# EAGLE schematic untitled (EAGLE 7.3.0)
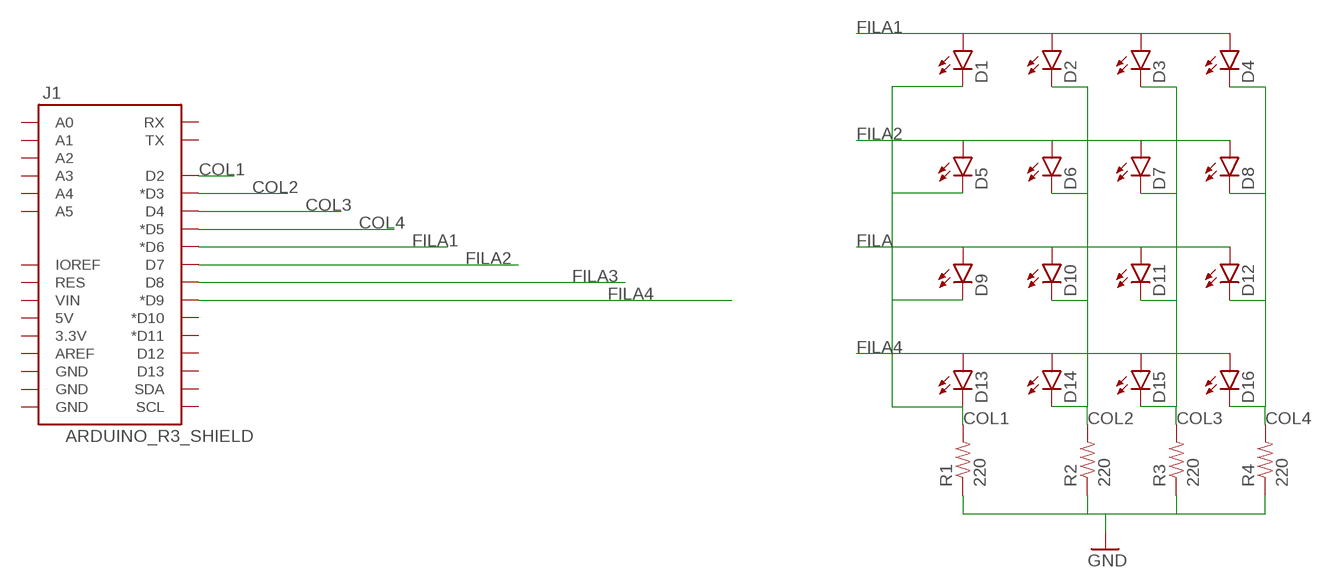
[diagram p0: schematic, sheet 1]

## Parts
D1  LED5MM  [LED5MM]
D2  LED5MM  [LED5MM]
D3  LED5MM  [LED5MM]
D4  LED5MM  [LED5MM]
D5  LED5MM  [LED5MM]
D6  LED5MM  [LED5MM]
D7  LED5MM  [LED5MM]
D8  LED5MM  [LED5MM]
D9  LED5MM  [LED5MM]
D10  LED5MM  [LED5MM]
D11  LED5MM  [LED5MM]
D12  LED5MM  [LED5MM]
D13  LED5MM  [LED5MM]
D14  LED5MM  [LED5MM]
D15  LED5MM  [LED5MM]
D16  LED5MM  [LED5MM]
J1  ARDUINO_R3_SHIELD  [UNO_R3_SHIELD]
R1  220  RESISTORPTH-1/4W  [AXIAL-0.4]
R2  220  RESISTORPTH-1/4W  [AXIAL-0.4]
R3  220  RESISTORPTH-1/4W  [AXIAL-0.4]
R4  220  RESISTORPTH-1/4W  [AXIAL-0.4]

## Nets
COL1: D1.K(C) D5.K(C) D9.K(C) D13.K(C) J1.D2 R1.P$2
COL2: D2.K(C) D6.K(C) D10.K(C) D14.K(C) J1.D3(*D3) R2.P$2
COL3: D3.K(C) D7.K(C) D11.K(C) D15.K(C) J1.D4 R3.P$2
COL4: D4.K(C) D8.K(C) D12.K(C) D16.K(C) J1.D5(*D5) R4.P$2
FILA: D12.A
FILA1: D4.A J1.D6(*D6)
FILA2: D8.A J1.D7
FILA3: J1.D8
FILA4: D16.A J1.D9(*D9)
GND: R1.P$1 R2.P$1 R3.P$1 R4.P$1
Unconnected: D1.A D2.A D3.A D5.A D6.A D7.A D9.A D10.A D11.A D13.A D14.A D15.A J1.3.3V J1.5V J1.A0 J1.A1 J1.A2 J1.A3 J1.A4 J1.A5 J1.AREF J1.D10(*D10) J1.D11(*D11) J1.D12 J1.D13 J1.GND@0(GND) J1.GND@1(GND) J1.GND@2(GND) J1.IOREF J1.RES J1.RX J1.SCL J1.SDA J1.TX J1.VIN

## Library data of the parts
D1-D16 = SparkFun-LED:LED: LEDs Standard schematic elements and footprints for 5mm, 3mm, 1206, and 0603 sized LEDs. 5mm - Spark Fun Electronics SKU : COM-00529 (and others)
J1 = SparkFun-Boards:ARDUINO_R3_SHIELD: Shield form compatible with the Arduino Uno R3.
R1-R4 = SparkFun-Resistors:RESISTOR: Resistor Basic schematic elements and footprints for 0603, 1206, and PTH resistors.